# EAGLE schematic Word-Clock (EAGLE 7.3.0)

## Sheet 1 of 4
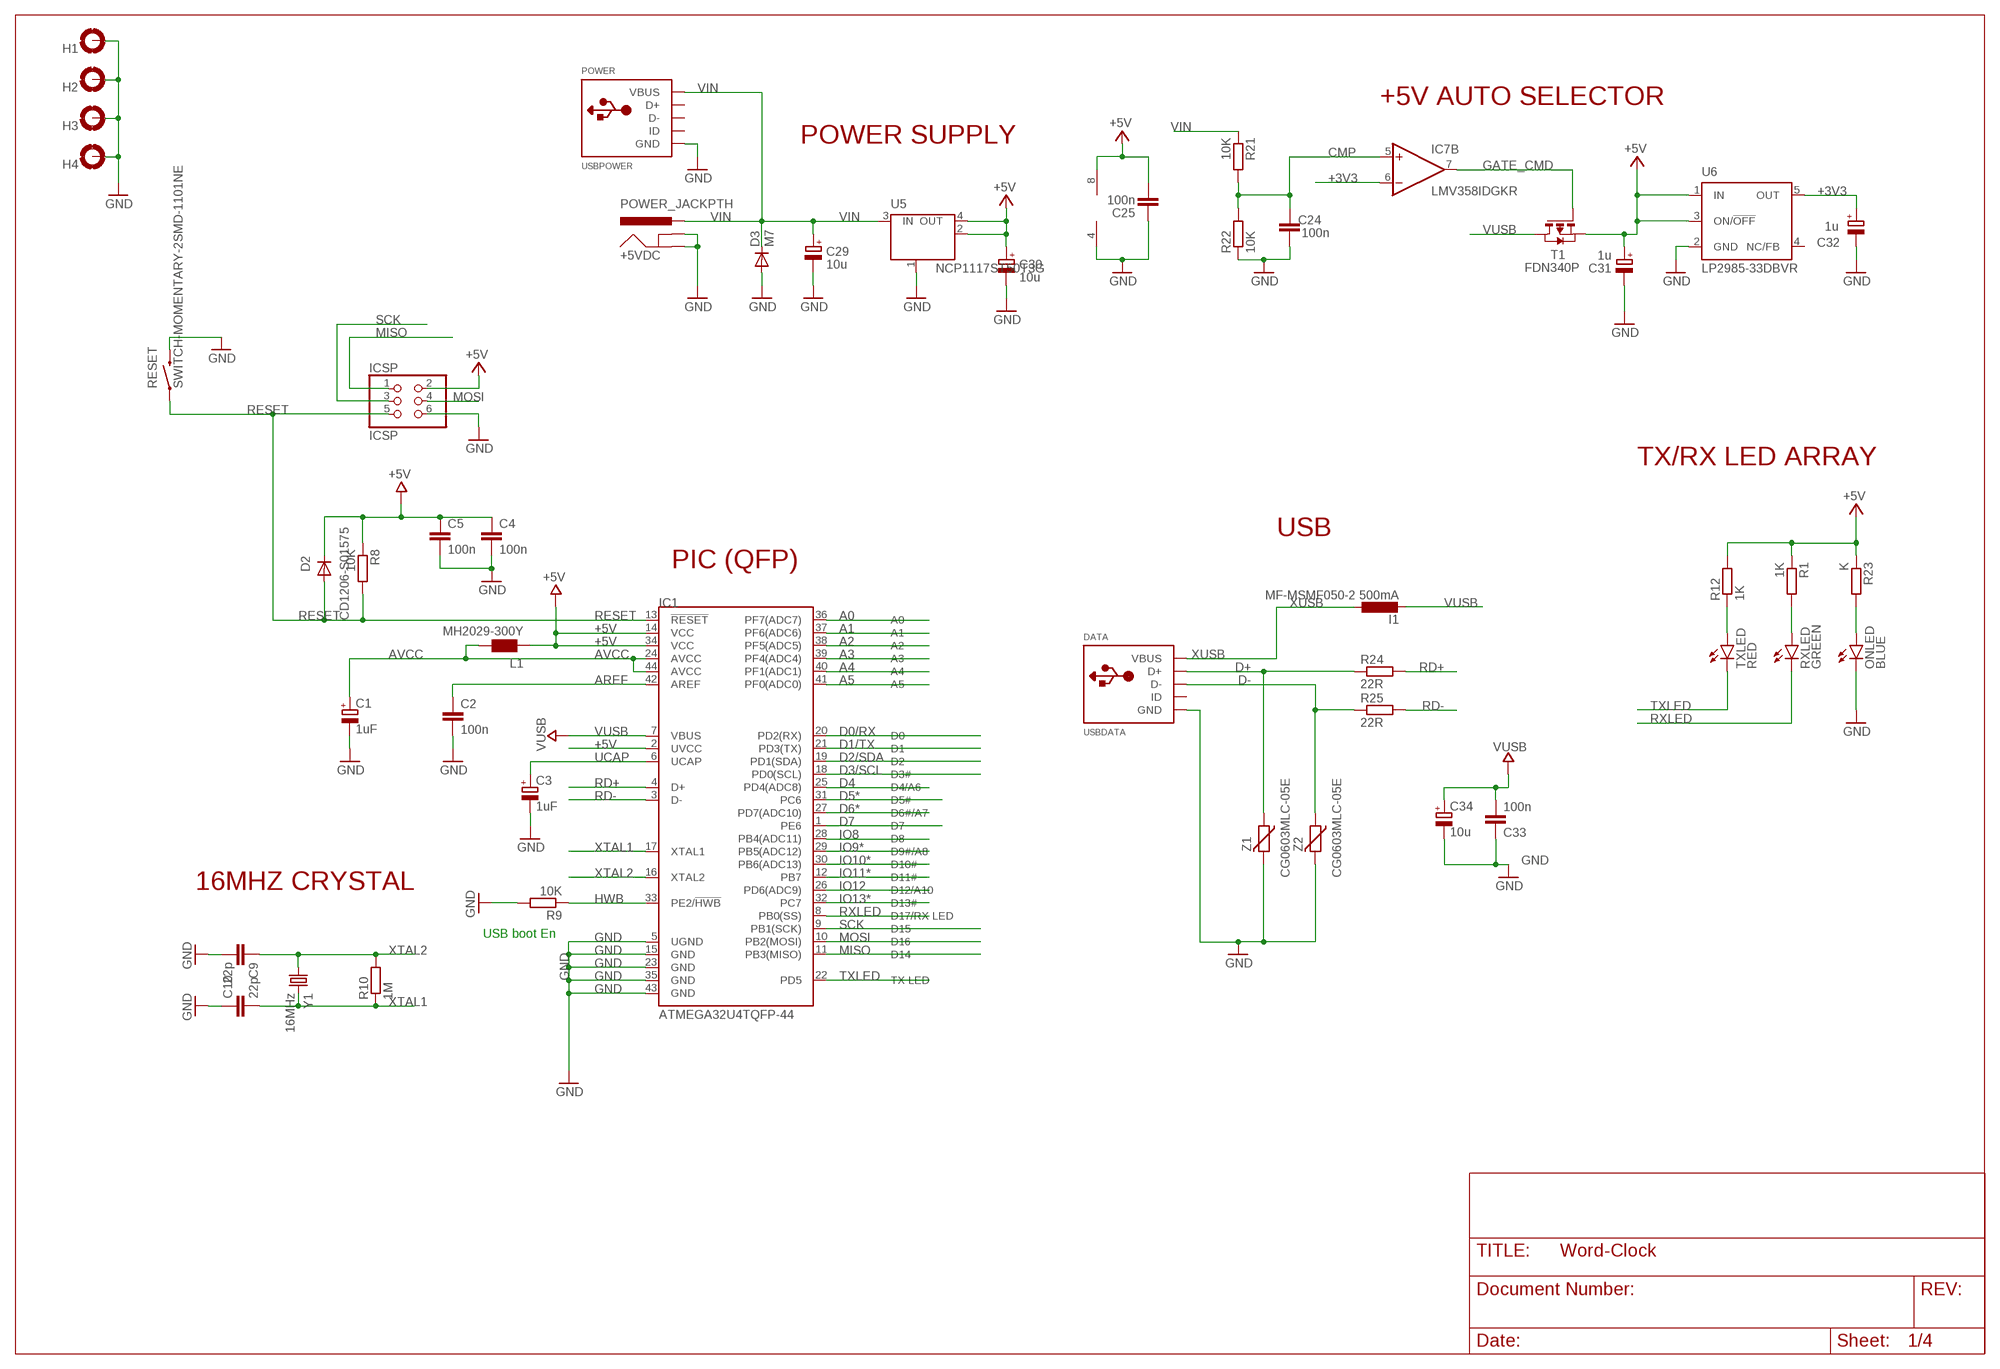
[diagram p0: schematic, sheet 1]

### Parts
+5VDC  POWER_JACKPTH  [POWER_JACK_PTH]
C1  1uF  CPOL-EUB/3528-21W  [B/3528-21W]
C2  100n  C-EUC1206  [C1206]
C3  1uF  CPOL-EUB/3528-21W  [B/3528-21W]
C4  100n  C-EUC1206  [C1206]
C5  100n  C-EUC1206  [C1206]
C9  22p  C-EUC1206  [C1206]
C10  22p  C-EUC1206  [C1206]
C24  100n  C-EUC1206  [C1206]
C25  100n  C-EUC1206  [C1206]
C29  10u  CPOL-EUB/3528-21W  [B/3528-21W]
C30  10u  CPOL-EUB/3528-21W  [B/3528-21W]
C31  1u  CPOL-EUB/3528-21W  [B/3528-21W]
C32  1u  CPOL-EUB/3528-21W  [B/3528-21W]
C33  100n  C-EUC1206  [C1206]
C34  10u  CPOL-EUB/3528-21W  [B/3528-21W]
D2  CD1206-S01575  DIODE-MINIMELF  [MINIMELF]
D3  M7  DIODE-SMB  [SMB]
DATA  USBDATA  USBMOLEX  [USB-MINIB-THM-MOLEX]
H1  MOUNT-PAD-ROUND2.8  [2,8-PAD]
H2  MOUNT-PAD-ROUND2.8  [2,8-PAD]
H3  MOUNT-PAD-ROUND2.8  [2,8-PAD]
H4  MOUNT-PAD-ROUND2.8  [2,8-PAD]
I1  MF-MSMF050-2 500mA  L-EUL1812  [L1812]
IC1  ATMEGA32U4TQFP-44  [TQFP44]
IC7  LMV358IDGKR  LMV358MX  [SO08]
ICSP  ICSP  PINHD-2X3/90  [2X03/90]
L1  MH2029-300Y  WE-CBF_0805  [0805]
ONLED  BLUE  LED-BLUE1206  [LED-1206]
POWER  USBPOWER  USBMOLEX  [USB-MINIB-THM-MOLEX]
R1  1K  R-EU_R1206  [R1206]
R8  10K  R-EU_R1206  [R1206]
R9  10K  R-EU_R1206  [R1206]
R10  1M  R-EU_R1206  [R1206]
R12  1K  R-EU_R1206  [R1206]
R21  10K  R-EU_R1206  [R1206]
R22  10K  R-EU_R1206  [R1206]
R23  K  R-EU_R1206  [R1206]
R24  22R  R-EU_R1206  [R1206]
R25  22R  R-EU_R1206  [R1206]
RESET  SWITCH-MOMENTARY-2SMD-1101NE  [TACTILE-SWITCH-1101NE]
RXLED  GREEN  LED-GREEN1206  [LED-1206]
T1  FDN340P  PMOSSOT23  [SOT-23]
TXLED  RED  LED-RED1206  [LED-1206]
U5  NCP1117ST50T3G  MC33269ST-3.3T3  [SOT223]
U6  LP2985-33DBVR  LP2985-XXDBVR33  [SOT23-DBV]
Y1  16MHz  CRYSTALSMD  [HC49UP]
Z1  CG0603MLC-05E  VARISTORCN0603  [CT/CN0603]
Z2  CG0603MLC-05E  VARISTORCN0603  [CT/CN0603]

### Nets
+3V3: C32.+ IC7.6(B:-IN) U6.5(OUT)
+5V [usbvcc]: C4.1 C5.1 C25.2 C30.+ C31.+ D2.C IC1.2(UVCC) IC1.14(VCC) IC1.34(VCC) IC7.8(P:V+) ICSP.2 L1.1 R1.1 R8.1 R12.2 R23.1 T1.2(S) U5.2(OUT) U5.4(OUT) U6.1(IN) U6.3(ON/!OFF) ; also sheet 2,3
A0: IC1.36(PF7(ADC7)) ; also sheet 3
A1: IC1.37(PF6(ADC6)) ; also sheet 3
A2: IC1.38(PF5(ADC5)) ; also sheet 3
A3: IC1.39(PF4(ADC4)) ; also sheet 3
A4: IC1.40(PF1(ADC1)) ; also sheet 3
A5: IC1.41(PF0(ADC0)) ; also sheet 3
AREF [aref]: C2.1 IC1.42(AREF)
AVCC: C1.+ IC1.24(AVCC) IC1.44(AVCC) L1.2
CMP: C24.2 IC7.5(B:+IN) R21.2 R22.2
D0/RX: IC1.20(PD2(RX)) ; also sheet 2
D1/TX: IC1.21(PD3(TX)) ; also sheet 2
D2/SDA: IC1.19(PD1(SDA)) ; also sheet 2
D3/SCL: IC1.18(PD0(SCL)) ; also sheet 2
D4: IC1.25(PD4(ADC8)) ; also sheet 3
D5*: IC1.31(PC6) ; also sheet 3
D6*: IC1.27(PD7(ADC10)) ; also sheet 3
D7: IC1.1(PE6) ; also sheet 4
D+: DATA.D+ R24.1 Z1.1
D-: DATA.D- R25.1 Z2.1
GATE_CMD: IC7.7(B:OUT) T1.3(G)
GND [gnd]: +5VDC.GND +5VDC.GNDBREAK C1.- C2.2 C3.- C4.2 C5.2 C9.2 C10.1 C24.1 C25.1 C29.- C30.- C31.- C32.- C33.1 C34.- D3.A DATA.GND H1.B2,8(MOUNT) H2.B2,8(MOUNT) H3.B2,8(MOUNT) H4.B2,8(MOUNT) IC1.5(UGND) IC1.15(GND) IC1.23(GND) IC1.35(GND) IC1.43(GND) IC7.4(P:V-) ICSP.6 ONLED.C POWER.GND R9.2 R22.1 RESET.2 U5.1(GND/ADJ) U6.2(GND) Z1.2 Z2.2 ; also sheet 2,3,4
HWB: IC1.33(PE2/!HWB) R9.1
IO8: IC1.28(PB4(ADC11)) ; also sheet 3
IO9*: IC1.29(PB5(ADC12)) ; also sheet 2
IO10*: IC1.30(PB6(ADC13)) ; also sheet 2
IO11*: IC1.12(PB7) ; also sheet 2
IO12: IC1.26(PD6(ADC9)) ; also sheet 3
IO13*: IC1.32(PC7) ; also sheet 3
MISO: IC1.11(PB3(MISO)) ICSP.1
MOSI: IC1.10(PB2(MOSI)) ICSP.4
N$1: R12.1 TXLED.A
N$2: R1.2 RXLED.A
N$3: ONLED.A R23.2
RD+: IC1.4(D+) R24.2
RD-: IC1.3(D-) R25.2
RESET: D2.A IC1.13(!RESET) ICSP.5 R8.2 RESET.1
RXLED: IC1.8(PB0(SS)) RXLED.C
SCK: IC1.9(PB1(SCK)) ICSP.3
TXLED: IC1.22(PD5) TXLED.C
UCAP: C3.+ IC1.6(UCAP)
VIN [power]: +5VDC.PWR C29.+ D3.C POWER.VBUS R21.1 U5.3(IN) ; also sheet 4
VUSB: C33.2 C34.+ I1.2 IC1.7(VBUS) T1.1(D)
XTAL1: C10.2 IC1.17(XTAL1) R10.1 Y1.2
XTAL2: C9.1 IC1.16(XTAL2) R10.2 Y1.1
XUSB [usbvcc]: DATA.VBUS I1.1
Unconnected: DATA.ID IC7.1(A:OUT) IC7.2(A:-IN) IC7.3(A:+IN) POWER.D+ POWER.D- POWER.ID U6.4(NC/FB)

### Notes on the sheet
- +5V AUTO SELECTOR
- POWER SUPPLY
- TX/RX LED ARRAY
- USB
- PIC (QFP)
- 16MHZ CRYSTAL
- USB boot En

## Sheet 2 of 4
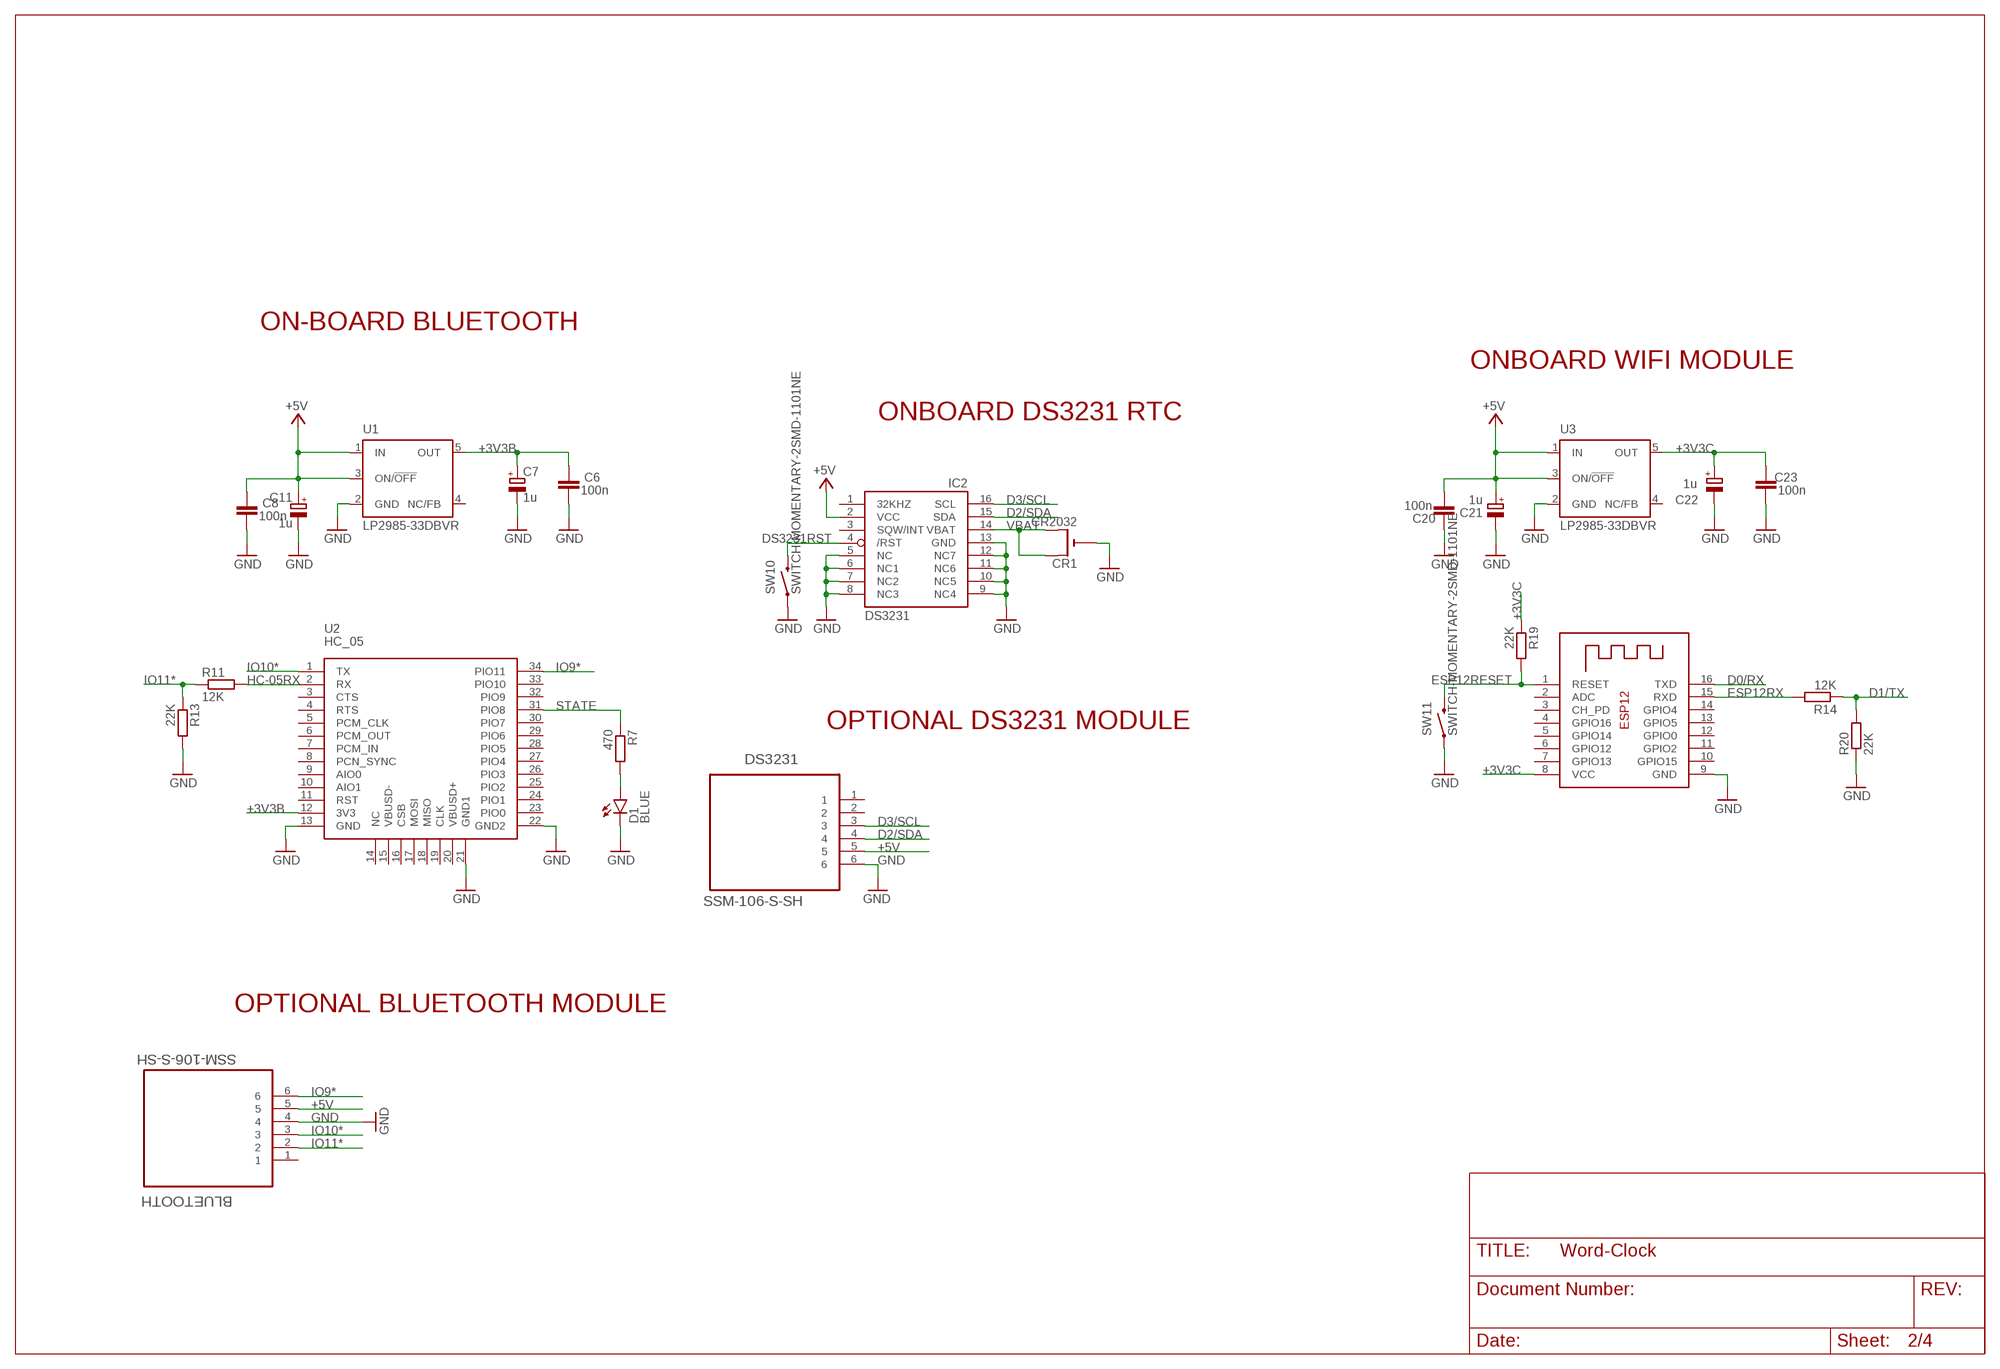
[diagram p1: schematic, sheet 2]

### Parts
BLUETOOTH  SSM-106-S-SH  [SAMTEC_SSM-106-S-SH]
C6  100n  C-EUC1206  [C1206]
C7  1u  CPOL-EUB/3528-21W  [B/3528-21W]
C8  100n  C-EUC1206  [C1206]
C11  1u  CPOL-EUB/3528-21W  [B/3528-21W]
C20  100n  C-EUC1206  [C1206]
C21  1u  CPOL-EUB/3528-21W  [B/3528-21W]
C22  1u  CPOL-EUB/3528-21W  [B/3528-21W]
C23  100n  C-EUC1206  [C1206]
CR1  CR2032  CR2032SMT  [CR2032-SMD]
D1  BLUE  LED-BLUE1206  [LED-1206]
DS3231  SSM-106-S-SH  [SAMTEC_SSM-106-S-SH]
ESP12  ESP12  ESP-12  [ESP-12]
IC2  DS3231/SO  [SO16W]
R7  470  R-EU_R1206  [R1206]
R11  12K  R-EU_R1206  [R1206]
R13  22K  R-EU_R1206  [R1206]
R14  12K  R-EU_R1206  [R1206]
R19  22K  R-EU_R1206  [R1206]
R20  22K  R-EU_R1206  [R1206]
SW10  SWITCH-MOMENTARY-2SMD-1101NE  [TACTILE-SWITCH-1101NE]
SW11  SWITCH-MOMENTARY-2SMD-1101NE  [TACTILE-SWITCH-1101NE]
U1  LP2985-33DBVR  LP2985-XXDBVR33  [SOT23-DBV]
U2  HC_05  [BLUETOOTH_SMD]
U3  LP2985-33DBVR  LP2985-XXDBVR33  [SOT23-DBV]

### Nets
+3V3B: C6.2 C7.+ U1.5(OUT) U2.12(3V3)
+3V3C: C22.+ C23.2 ESP12.8(VCC) R19.1 U3.5(OUT)
+5V [usbvcc]: BLUETOOTH.5 C8.2 C11.+ C20.1 C21.+ DS3231.5 IC2.2(VCC) U1.1(IN) U1.3(ON/!OFF) U3.1(IN) U3.3(ON/!OFF) ; also sheet 1,3
BLUETOOTHLED: D1.A R7.2
D0/RX: ESP12.16(TXD) ; also sheet 1
D1/TX: R14.1 R20.2 ; also sheet 1
D2/SDA: DS3231.4 IC2.15(SDA) ; also sheet 1
D3/SCL: DS3231.3 IC2.16(SCL) ; also sheet 1
DS3231RST: IC2.4(/RST) SW10.2
ESP12RESET: ESP12.1(RESET) R19.2 SW11.2
ESP12RX: ESP12.15(RXD) R14.2
GND [gnd]: BLUETOOTH.4 C6.1 C7.- C8.1 C11.- C20.2 C21.- C22.- C23.1 CR1.- D1.C DS3231.6 ESP12.9(GND) IC2.5(NC) IC2.6(NC1) IC2.7(NC2) IC2.8(NC3) IC2.9(NC4) IC2.10(NC5) IC2.11(NC6) IC2.12(NC7) IC2.13(GND) R13.2 R20.1 SW10.1 SW11.1 U1.2(GND) U2.13(GND) U2.21(GND1) U2.22(GND2) U3.2(GND) ; also sheet 1,3,4
HC-05RX: R11.2 U2.2(RX)
IO9*: BLUETOOTH.6 U2.34(PIO11) ; also sheet 1
IO10*: BLUETOOTH.3 U2.1(TX) ; also sheet 1
IO11*: BLUETOOTH.2 R11.1 R13.1 ; also sheet 1
STATE: R7.1 U2.31(PIO8)
VBAT: CR1.+$1(+) CR1.+$2(+1) IC2.14(VBAT)
Unconnected: BLUETOOTH.1 DS3231.1 DS3231.2 ESP12.2(ADC) ESP12.3(CH_PD) ESP12.4(GPIO16) ESP12.5(GPIO14) ESP12.6(GPIO12) ESP12.7(GPIO13) ESP12.10(GPIO15) ESP12.11(GPIO2) ESP12.12(GPIO0) ESP12.13(GPIO5) ESP12.14(GPIO4) IC2.1(32KHZ) IC2.3(SQW/INT) U1.4(NC/FB) U2.3(CTS) U2.4(RTS) U2.5(PCM_CLK) U2.6(PCM_OUT) U2.7(PCM_IN) U2.8(PCN_SYNC) U2.9(AIO0) U2.10(AIO1) U2.11(RST) U2.14(NC) U2.15(VBUSD-) U2.16(CSB) U2.17(MOSI) U2.18(MISO) U2.19(CLK) U2.20(VBUSD+) U2.23(PIO0) U2.24(PIO1) U2.25(PIO2) U2.26(PIO3) U2.27(PIO4) U2.28(PIO5) U2.29(PIO6) U2.30(PIO7) U2.32(PIO9) U2.33(PIO10) U3.4(NC/FB)

### Notes on the sheet
- ON-BOARD BLUETOOTH
- ONBOARD WIFI MODULE
- ONBOARD DS3231 RTC
- OPTIONAL DS3231 MODULE
- OPTIONAL BLUETOOTH MODULE

## Sheet 3 of 4
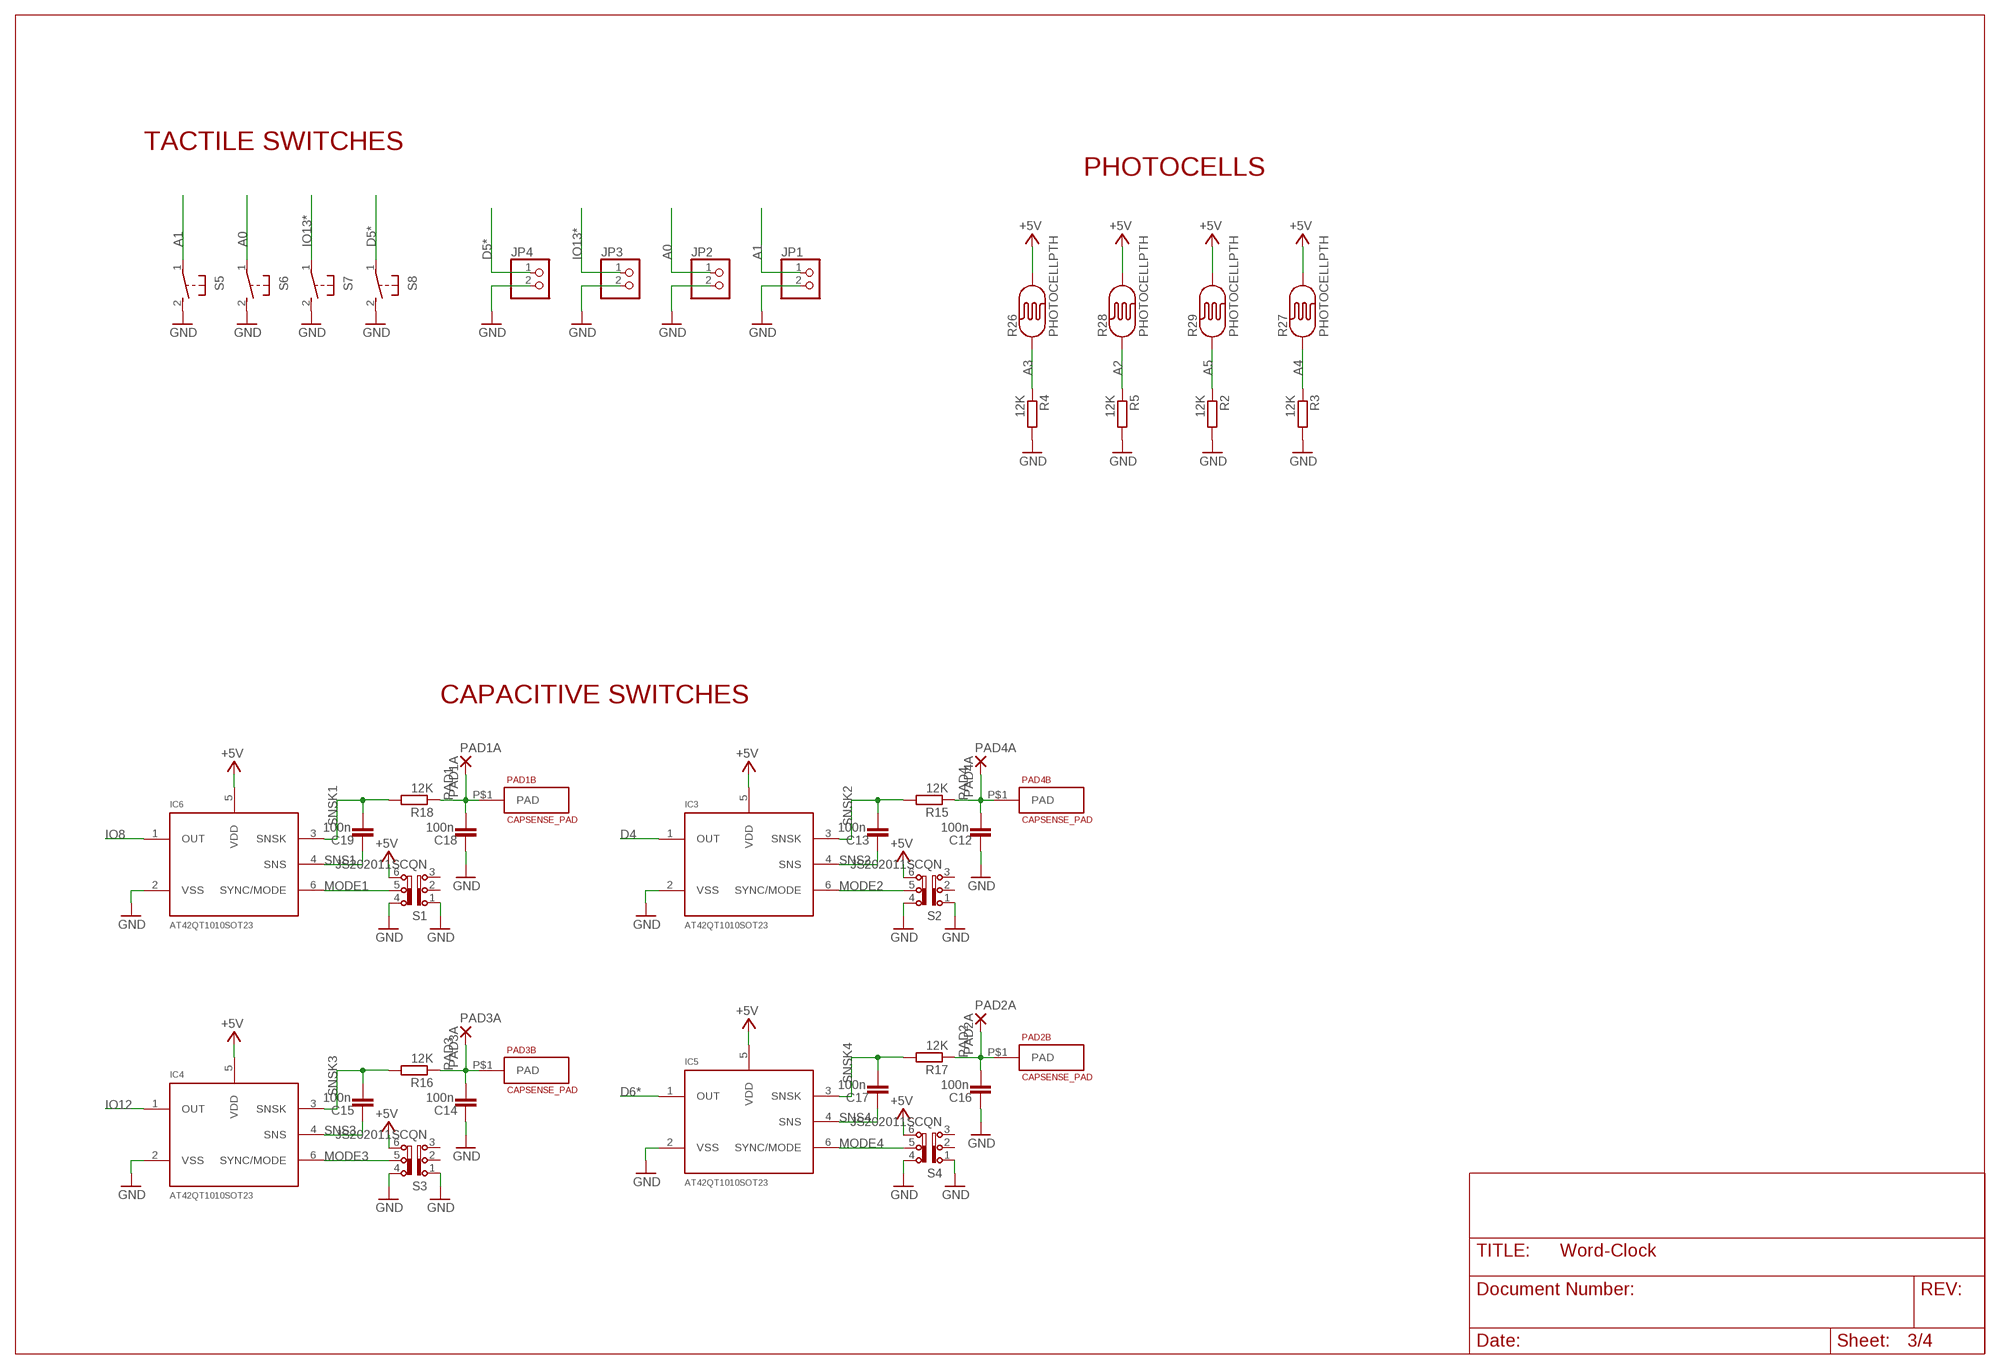
[diagram p2: schematic, sheet 3]

### Parts
C12  100n  C-EUC1206  [C1206]
C13  100n  C-EUC1206  [C1206]
C14  100n  C-EUC1206  [C1206]
C15  100n  C-EUC1206  [C1206]
C16  100n  C-EUC1206  [C1206]
C17  100n  C-EUC1206  [C1206]
C18  100n  C-EUC1206  [C1206]
C19  100n  C-EUC1206  [C1206]
IC3  AT42QT1010SOT23  [SOT23-6]
IC4  AT42QT1010SOT23  [SOT23-6]
IC5  AT42QT1010SOT23  [SOT23-6]
IC6  AT42QT1010SOT23  [SOT23-6]
JP1  PINHD-1X2/90  [1X02/90]
JP2  PINHD-1X2/90  [1X02/90]
JP3  PINHD-1X2/90  [1X02/90]
JP4  PINHD-1X2/90  [1X02/90]
PAD1A  PAD1A  2,54/1,0  [2,54/1,0]
PAD1B  CAPSENSE_PAD  [CAPSENSE_PAD]
PAD2A  PAD2A  2,54/1,0  [2,54/1,0]
PAD2B  CAPSENSE_PAD  [CAPSENSE_PAD]
PAD3A  PAD3A  2,54/1,0  [2,54/1,0]
PAD3B  CAPSENSE_PAD  [CAPSENSE_PAD]
PAD4A  PAD4A  2,54/1,0  [2,54/1,0]
PAD4B  CAPSENSE_PAD  [CAPSENSE_PAD]
R2  12K  R-EU_R1206  [R1206]
R3  12K  R-EU_R1206  [R1206]
R4  12K  R-EU_R1206  [R1206]
R5  12K  R-EU_R1206  [R1206]
R15  12K  R-EU_R1206  [R1206]
R16  12K  R-EU_R1206  [R1206]
R17  12K  R-EU_R1206  [R1206]
R18  12K  R-EU_R1206  [R1206]
R26  PHOTOCELLPTH  [PHOTOCELL]
R27  PHOTOCELLPTH  [PHOTOCELL]
R28  PHOTOCELLPTH  [PHOTOCELL]
R29  PHOTOCELLPTH  [PHOTOCELL]
S1  JS202011SCQN  [JS202011SCQN]
S2  JS202011SCQN  [JS202011SCQN]
S3  JS202011SCQN  [JS202011SCQN]
S4  JS202011SCQN  [JS202011SCQN]
S5  31-XX  [B3F-31XX]
S6  31-XX  [B3F-31XX]
S7  31-XX  [B3F-31XX]
S8  31-XX  [B3F-31XX]

### Nets
+5V [usbvcc]: IC3.5(VDD) IC4.5(VDD) IC5.5(VDD) IC6.5(VDD) R26.2 R27.2 R28.2 R29.2 S1.6 S2.6 S3.6 S4.6 ; also sheet 1,2
A0: JP2.1 S6.1(P) ; also sheet 1
A1: JP1.1 S5.1(P) ; also sheet 1
A2: R5.1 R28.1 ; also sheet 1
A3: R4.1 R26.1 ; also sheet 1
A4: R3.1 R27.1 ; also sheet 1
A5: R2.1 R29.1 ; also sheet 1
D4: IC3.1(OUT) ; also sheet 1
D5*: JP4.1 S8.1(P) ; also sheet 1
D6*: IC5.1(OUT) ; also sheet 1
GND [gnd]: C12.2 C14.2 C16.2 C18.2 IC3.2(VSS) IC4.2(VSS) IC5.2(VSS) IC6.2(VSS) JP1.2 JP2.2 JP3.2 JP4.2 R2.2 R3.2 R4.2 R5.2 S1.1 S1.4 S2.1 S2.4 S3.1 S3.4 S4.1 S4.4 S5.2(S) S6.2(S) S7.2(S) S8.2(S) ; also sheet 1,2,4
IO8: IC6.1(OUT) ; also sheet 1
IO12: IC4.1(OUT) ; also sheet 1
IO13*: JP3.1 S7.1(P) ; also sheet 1
MODE1: IC6.6(SYNC/MODE) S1.5
MODE2: IC3.6(SYNC/MODE) S2.5
MODE3: IC4.6(SYNC/MODE) S3.5
MODE4: IC5.6(SYNC/MODE) S4.5
PAD1: C18.1 PAD1A.1(P) PAD1B.P$1(PAD) R18.1
PAD2: C16.1 PAD2A.1(P) PAD2B.P$1(PAD) R17.1
PAD3: C14.1 PAD3A.1(P) PAD3B.P$1(PAD) R16.1
PAD4: C12.1 PAD4A.1(P) PAD4B.P$1(PAD) R15.1
SNS1: C19.2 IC6.4(SNS)
SNS2: C13.2 IC3.4(SNS)
SNS3: C15.2 IC4.4(SNS)
SNS4: C17.2 IC5.4(SNS)
SNSK1: C19.1 IC6.3(SNSK) R18.2
SNSK2: C13.1 IC3.3(SNSK) R15.2
SNSK3: C15.1 IC4.3(SNSK) R16.2
SNSK4: C17.1 IC5.3(SNSK) R17.2
Unconnected: S1.2 S1.3 S2.2 S2.3 S3.2 S3.3 S4.2 S4.3

### Notes on the sheet
- TACTILE SWITCHES
- PHOTOCELLS
- CAPACITIVE SWITCHES

## Sheet 4 of 4
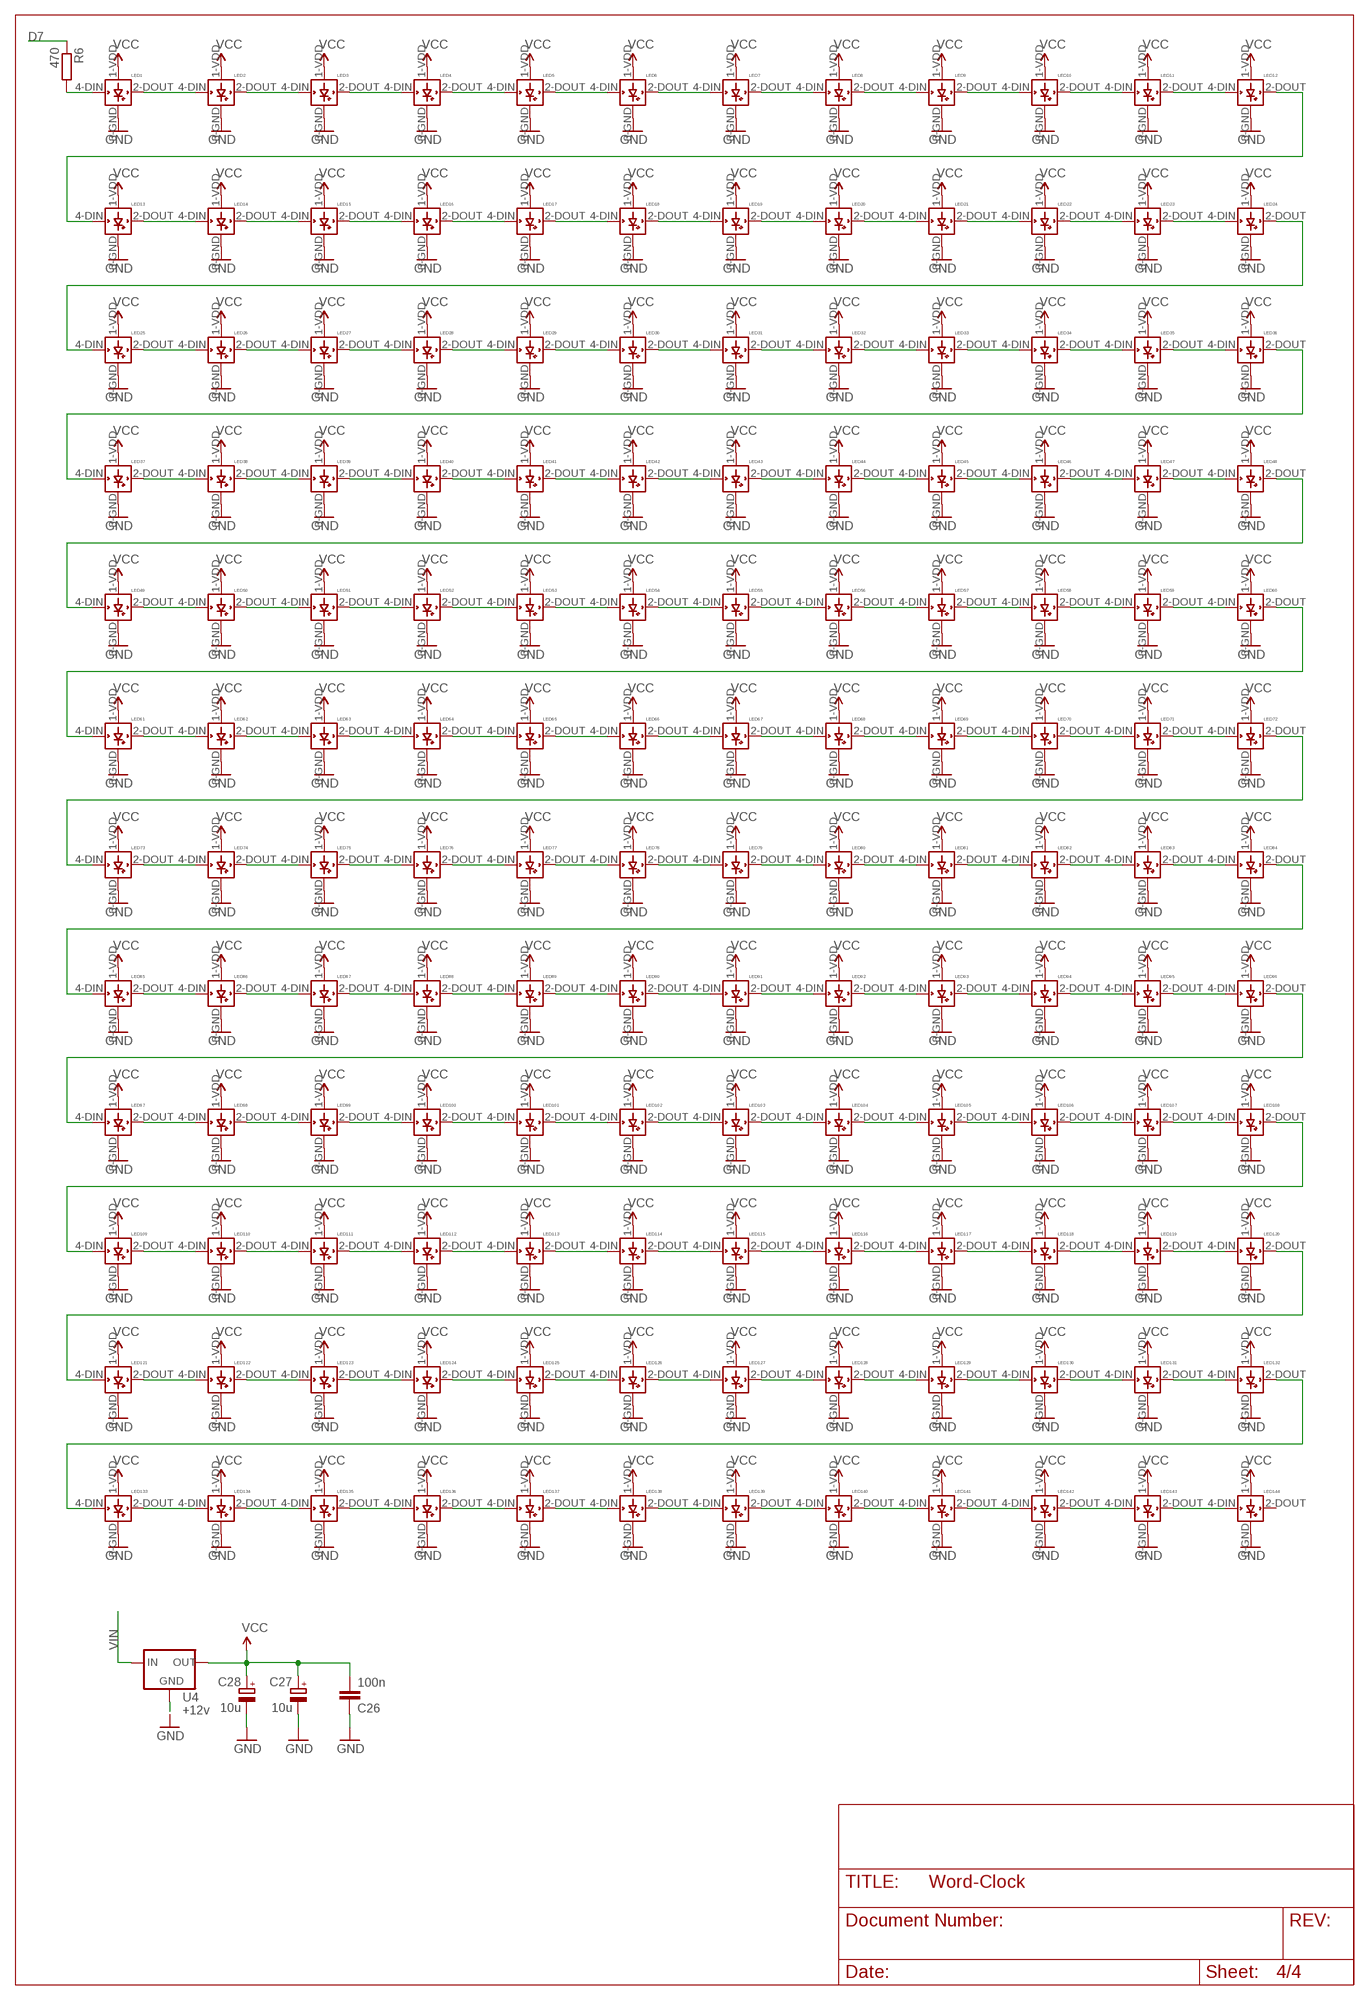
[diagram p3: schematic, sheet 4]

### Parts
C26  100n  C-EUC1206  [C1206]
C27  10u  CPOL-EUB/3528-21W  [B/3528-21W]
C28  10u  CPOL-EUB/3528-21W  [B/3528-21W]
LED1  WS2812B  [WS2812B]
LED2  WS2812B  [WS2812B]
LED3  WS2812B  [WS2812B]
LED4  WS2812B  [WS2812B]
LED5  WS2812B  [WS2812B]
LED6  WS2812B  [WS2812B]
LED7  WS2812B  [WS2812B]
LED8  WS2812B  [WS2812B]
LED9  WS2812B  [WS2812B]
LED10  WS2812B  [WS2812B]
LED11  WS2812B  [WS2812B]
LED12  WS2812B  [WS2812B]
LED13  WS2812B  [WS2812B]
LED14  WS2812B  [WS2812B]
LED15  WS2812B  [WS2812B]
LED16  WS2812B  [WS2812B]
LED17  WS2812B  [WS2812B]
LED18  WS2812B  [WS2812B]
LED19  WS2812B  [WS2812B]
LED20  WS2812B  [WS2812B]
LED21  WS2812B  [WS2812B]
LED22  WS2812B  [WS2812B]
LED23  WS2812B  [WS2812B]
LED24  WS2812B  [WS2812B]
LED25  WS2812B  [WS2812B]
LED26  WS2812B  [WS2812B]
LED27  WS2812B  [WS2812B]
LED28  WS2812B  [WS2812B]
LED29  WS2812B  [WS2812B]
LED30  WS2812B  [WS2812B]
LED31  WS2812B  [WS2812B]
LED32  WS2812B  [WS2812B]
LED33  WS2812B  [WS2812B]
LED34  WS2812B  [WS2812B]
LED35  WS2812B  [WS2812B]
LED36  WS2812B  [WS2812B]
LED37  WS2812B  [WS2812B]
LED38  WS2812B  [WS2812B]
LED39  WS2812B  [WS2812B]
LED40  WS2812B  [WS2812B]
LED41  WS2812B  [WS2812B]
LED42  WS2812B  [WS2812B]
LED43  WS2812B  [WS2812B]
LED44  WS2812B  [WS2812B]
LED45  WS2812B  [WS2812B]
LED46  WS2812B  [WS2812B]
LED47  WS2812B  [WS2812B]
LED48  WS2812B  [WS2812B]
LED49  WS2812B  [WS2812B]
LED50  WS2812B  [WS2812B]
LED51  WS2812B  [WS2812B]
LED52  WS2812B  [WS2812B]
LED53  WS2812B  [WS2812B]
LED54  WS2812B  [WS2812B]
LED55  WS2812B  [WS2812B]
LED56  WS2812B  [WS2812B]
LED57  WS2812B  [WS2812B]
LED58  WS2812B  [WS2812B]
LED59  WS2812B  [WS2812B]
LED60  WS2812B  [WS2812B]
LED61  WS2812B  [WS2812B]
LED62  WS2812B  [WS2812B]
LED63  WS2812B  [WS2812B]
LED64  WS2812B  [WS2812B]
LED65  WS2812B  [WS2812B]
LED66  WS2812B  [WS2812B]
LED67  WS2812B  [WS2812B]
LED68  WS2812B  [WS2812B]
LED69  WS2812B  [WS2812B]
LED70  WS2812B  [WS2812B]
LED71  WS2812B  [WS2812B]
LED72  WS2812B  [WS2812B]
LED73  WS2812B  [WS2812B]
LED74  WS2812B  [WS2812B]
LED75  WS2812B  [WS2812B]
LED76  WS2812B  [WS2812B]
LED77  WS2812B  [WS2812B]
LED78  WS2812B  [WS2812B]
LED79  WS2812B  [WS2812B]
LED80  WS2812B  [WS2812B]
LED81  WS2812B  [WS2812B]
LED82  WS2812B  [WS2812B]
LED83  WS2812B  [WS2812B]
LED84  WS2812B  [WS2812B]
LED85  WS2812B  [WS2812B]
LED86  WS2812B  [WS2812B]
LED87  WS2812B  [WS2812B]
LED88  WS2812B  [WS2812B]
LED89  WS2812B  [WS2812B]
LED90  WS2812B  [WS2812B]
LED91  WS2812B  [WS2812B]
LED92  WS2812B  [WS2812B]
LED93  WS2812B  [WS2812B]
LED94  WS2812B  [WS2812B]
LED95  WS2812B  [WS2812B]
LED96  WS2812B  [WS2812B]
LED97  WS2812B  [WS2812B]
LED98  WS2812B  [WS2812B]
LED99  WS2812B  [WS2812B]
LED100  WS2812B  [WS2812B]
LED101  WS2812B  [WS2812B]
LED102  WS2812B  [WS2812B]
LED103  WS2812B  [WS2812B]
LED104  WS2812B  [WS2812B]
LED105  WS2812B  [WS2812B]
LED106  WS2812B  [WS2812B]
LED107  WS2812B  [WS2812B]
LED108  WS2812B  [WS2812B]
LED109  WS2812B  [WS2812B]
LED110  WS2812B  [WS2812B]
LED111  WS2812B  [WS2812B]
LED112  WS2812B  [WS2812B]
LED113  WS2812B  [WS2812B]
LED114  WS2812B  [WS2812B]
LED115  WS2812B  [WS2812B]
LED116  WS2812B  [WS2812B]
LED117  WS2812B  [WS2812B]
LED118  WS2812B  [WS2812B]
LED119  WS2812B  [WS2812B]
LED120  WS2812B  [WS2812B]
LED121  WS2812B  [WS2812B]
LED122  WS2812B  [WS2812B]
LED123  WS2812B  [WS2812B]
LED124  WS2812B  [WS2812B]
LED125  WS2812B  [WS2812B]
LED126  WS2812B  [WS2812B]
LED127  WS2812B  [WS2812B]
LED128  WS2812B  [WS2812B]
LED129  WS2812B  [WS2812B]
LED130  WS2812B  [WS2812B]
LED131  WS2812B  [WS2812B]
LED132  WS2812B  [WS2812B]
LED133  WS2812B  [WS2812B]
LED134  WS2812B  [WS2812B]
LED135  WS2812B  [WS2812B]
LED136  WS2812B  [WS2812B]
LED137  WS2812B  [WS2812B]
LED138  WS2812B  [WS2812B]
LED139  WS2812B  [WS2812B]
LED140  WS2812B  [WS2812B]
LED141  WS2812B  [WS2812B]
LED142  WS2812B  [WS2812B]
LED143  WS2812B  [WS2812B]
LED144  WS2812B  [WS2812B]
R6  470  R-EU_R1206  [R1206]
U4  +12v  V_REG_78XX7812  [TO-252]

### Nets
D7: R6.1 ; also sheet 1
GND [gnd]: C26.1 C27.- C28.- LED1.3-GND(GND) LED2.3-GND(GND) LED3.3-GND(GND) LED4.3-GND(GND) LED5.3-GND(GND) LED6.3-GND(GND) LED7.3-GND(GND) LED8.3-GND(GND) LED9.3-GND(GND) LED10.3-GND(GND) LED11.3-GND(GND) LED12.3-GND(GND) LED13.3-GND(GND) LED14.3-GND(GND) LED15.3-GND(GND) LED16.3-GND(GND) LED17.3-GND(GND) LED18.3-GND(GND) LED19.3-GND(GND) LED20.3-GND(GND) LED21.3-GND(GND) LED22.3-GND(GND) LED23.3-GND(GND) LED24.3-GND(GND) LED25.3-GND(GND) LED26.3-GND(GND) LED27.3-GND(GND) LED28.3-GND(GND) LED29.3-GND(GND) LED30.3-GND(GND) LED31.3-GND(GND) LED32.3-GND(GND) LED33.3-GND(GND) LED34.3-GND(GND) LED35.3-GND(GND) LED36.3-GND(GND) LED37.3-GND(GND) LED38.3-GND(GND) LED39.3-GND(GND) LED40.3-GND(GND) LED41.3-GND(GND) LED42.3-GND(GND) LED43.3-GND(GND) LED44.3-GND(GND) LED45.3-GND(GND) LED46.3-GND(GND) LED47.3-GND(GND) LED48.3-GND(GND) LED49.3-GND(GND) LED50.3-GND(GND) LED51.3-GND(GND) LED52.3-GND(GND) LED53.3-GND(GND) LED54.3-GND(GND) LED55.3-GND(GND) LED56.3-GND(GND) LED57.3-GND(GND) LED58.3-GND(GND) LED59.3-GND(GND) LED60.3-GND(GND) LED61.3-GND(GND) LED62.3-GND(GND) LED63.3-GND(GND) LED64.3-GND(GND) LED65.3-GND(GND) LED66.3-GND(GND) LED67.3-GND(GND) LED68.3-GND(GND) LED69.3-GND(GND) LED70.3-GND(GND) LED71.3-GND(GND) LED72.3-GND(GND) LED73.3-GND(GND) LED74.3-GND(GND) LED75.3-GND(GND) LED76.3-GND(GND) LED77.3-GND(GND) LED78.3-GND(GND) LED79.3-GND(GND) LED80.3-GND(GND) LED81.3-GND(GND) LED82.3-GND(GND) LED83.3-GND(GND) LED84.3-GND(GND) LED85.3-GND(GND) LED86.3-GND(GND) LED87.3-GND(GND) LED88.3-GND(GND) LED89.3-GND(GND) LED90.3-GND(GND) LED91.3-GND(GND) LED92.3-GND(GND) LED93.3-GND(GND) LED94.3-GND(GND) LED95.3-GND(GND) LED96.3-GND(GND) LED97.3-GND(GND) LED98.3-GND(GND) LED99.3-GND(GND) LED100.3-GND(GND) LED101.3-GND(GND) LED102.3-GND(GND) LED103.3-GND(GND) LED104.3-GND(GND) LED105.3-GND(GND) LED106.3-GND(GND) LED107.3-GND(GND) LED108.3-GND(GND) LED109.3-GND(GND) LED110.3-GND(GND) LED111.3-GND(GND) LED112.3-GND(GND) LED113.3-GND(GND) LED114.3-GND(GND) LED115.3-GND(GND) LED116.3-GND(GND) LED117.3-GND(GND) LED118.3-GND(GND) LED119.3-GND(GND) LED120.3-GND(GND) LED121.3-GND(GND) LED122.3-GND(GND) LED123.3-GND(GND) LED124.3-GND(GND) LED125.3-GND(GND) LED126.3-GND(GND) LED127.3-GND(GND) LED128.3-GND(GND) LED129.3-GND(GND) LED130.3-GND(GND) LED131.3-GND(GND) LED132.3-GND(GND) LED133.3-GND(GND) LED134.3-GND(GND) LED135.3-GND(GND) LED136.3-GND(GND) LED137.3-GND(GND) LED138.3-GND(GND) LED139.3-GND(GND) LED140.3-GND(GND) LED141.3-GND(GND) LED142.3-GND(GND) LED143.3-GND(GND) LED144.3-GND(GND) U4.3(GND) ; also sheet 1,2,3
N$4: LED1.2-DOUT(DOUT) LED2.4-DIN(DIN)
N$5: LED2.2-DOUT(DOUT) LED3.4-DIN(DIN)
N$6: LED3.2-DOUT(DOUT) LED4.4-DIN(DIN)
N$7: LED4.2-DOUT(DOUT) LED5.4-DIN(DIN)
N$8: LED5.2-DOUT(DOUT) LED6.4-DIN(DIN)
N$9: LED6.2-DOUT(DOUT) LED7.4-DIN(DIN)
N$10: LED7.2-DOUT(DOUT) LED8.4-DIN(DIN)
N$11: LED8.2-DOUT(DOUT) LED9.4-DIN(DIN)
N$12: LED9.2-DOUT(DOUT) LED10.4-DIN(DIN)
N$13: LED10.2-DOUT(DOUT) LED11.4-DIN(DIN)
N$14: LED11.2-DOUT(DOUT) LED12.4-DIN(DIN)
N$15: LED13.2-DOUT(DOUT) LED14.4-DIN(DIN)
N$16: LED14.2-DOUT(DOUT) LED15.4-DIN(DIN)
N$17: LED15.2-DOUT(DOUT) LED16.4-DIN(DIN)
N$18: LED16.2-DOUT(DOUT) LED17.4-DIN(DIN)
N$19: LED17.2-DOUT(DOUT) LED18.4-DIN(DIN)
N$20: LED18.2-DOUT(DOUT) LED19.4-DIN(DIN)
N$21: LED19.2-DOUT(DOUT) LED20.4-DIN(DIN)
N$22: LED20.2-DOUT(DOUT) LED21.4-DIN(DIN)
N$23: LED21.2-DOUT(DOUT) LED22.4-DIN(DIN)
N$24: LED22.2-DOUT(DOUT) LED23.4-DIN(DIN)
N$25: LED23.2-DOUT(DOUT) LED24.4-DIN(DIN)
N$26: LED25.2-DOUT(DOUT) LED26.4-DIN(DIN)
N$27: LED26.2-DOUT(DOUT) LED27.4-DIN(DIN)
N$28: LED27.2-DOUT(DOUT) LED28.4-DIN(DIN)
N$29: LED28.2-DOUT(DOUT) LED29.4-DIN(DIN)
N$30: LED29.2-DOUT(DOUT) LED30.4-DIN(DIN)
N$31: LED30.2-DOUT(DOUT) LED31.4-DIN(DIN)
N$32: LED31.2-DOUT(DOUT) LED32.4-DIN(DIN)
N$33: LED32.2-DOUT(DOUT) LED33.4-DIN(DIN)
N$34: LED33.2-DOUT(DOUT) LED34.4-DIN(DIN)
N$35: LED34.2-DOUT(DOUT) LED35.4-DIN(DIN)
N$36: LED35.2-DOUT(DOUT) LED36.4-DIN(DIN)
N$37: LED37.2-DOUT(DOUT) LED38.4-DIN(DIN)
N$38: LED38.2-DOUT(DOUT) LED39.4-DIN(DIN)
N$39: LED39.2-DOUT(DOUT) LED40.4-DIN(DIN)
N$40: LED40.2-DOUT(DOUT) LED41.4-DIN(DIN)
N$41: LED41.2-DOUT(DOUT) LED42.4-DIN(DIN)
N$42: LED42.2-DOUT(DOUT) LED43.4-DIN(DIN)
N$43: LED43.2-DOUT(DOUT) LED44.4-DIN(DIN)
N$44: LED44.2-DOUT(DOUT) LED45.4-DIN(DIN)
N$45: LED45.2-DOUT(DOUT) LED46.4-DIN(DIN)
N$46: LED46.2-DOUT(DOUT) LED47.4-DIN(DIN)
N$47: LED47.2-DOUT(DOUT) LED48.4-DIN(DIN)
N$48: LED49.2-DOUT(DOUT) LED50.4-DIN(DIN)
N$49: LED50.2-DOUT(DOUT) LED51.4-DIN(DIN)
N$50: LED51.2-DOUT(DOUT) LED52.4-DIN(DIN)
N$51: LED52.2-DOUT(DOUT) LED53.4-DIN(DIN)
N$52: LED53.2-DOUT(DOUT) LED54.4-DIN(DIN)
N$53: LED54.2-DOUT(DOUT) LED55.4-DIN(DIN)
N$54: LED55.2-DOUT(DOUT) LED56.4-DIN(DIN)
N$55: LED56.2-DOUT(DOUT) LED57.4-DIN(DIN)
N$56: LED57.2-DOUT(DOUT) LED58.4-DIN(DIN)
N$57: LED58.2-DOUT(DOUT) LED59.4-DIN(DIN)
N$58: LED59.2-DOUT(DOUT) LED60.4-DIN(DIN)
N$59: LED61.2-DOUT(DOUT) LED62.4-DIN(DIN)
N$60: LED62.2-DOUT(DOUT) LED63.4-DIN(DIN)
N$61: LED63.2-DOUT(DOUT) LED64.4-DIN(DIN)
N$62: LED64.2-DOUT(DOUT) LED65.4-DIN(DIN)
N$63: LED65.2-DOUT(DOUT) LED66.4-DIN(DIN)
N$64: LED66.2-DOUT(DOUT) LED67.4-DIN(DIN)
N$65: LED67.2-DOUT(DOUT) LED68.4-DIN(DIN)
N$66: LED68.2-DOUT(DOUT) LED69.4-DIN(DIN)
N$67: LED69.2-DOUT(DOUT) LED70.4-DIN(DIN)
N$68: LED70.2-DOUT(DOUT) LED71.4-DIN(DIN)
N$69: LED71.2-DOUT(DOUT) LED72.4-DIN(DIN)
N$70: LED73.2-DOUT(DOUT) LED74.4-DIN(DIN)
N$71: LED74.2-DOUT(DOUT) LED75.4-DIN(DIN)
N$72: LED75.2-DOUT(DOUT) LED76.4-DIN(DIN)
N$73: LED76.2-DOUT(DOUT) LED77.4-DIN(DIN)
N$74: LED77.2-DOUT(DOUT) LED78.4-DIN(DIN)
N$75: LED78.2-DOUT(DOUT) LED79.4-DIN(DIN)
N$76: LED79.2-DOUT(DOUT) LED80.4-DIN(DIN)
N$77: LED80.2-DOUT(DOUT) LED81.4-DIN(DIN)
N$78: LED81.2-DOUT(DOUT) LED82.4-DIN(DIN)
N$79: LED82.2-DOUT(DOUT) LED83.4-DIN(DIN)
N$80: LED83.2-DOUT(DOUT) LED84.4-DIN(DIN)
N$81: LED85.2-DOUT(DOUT) LED86.4-DIN(DIN)
N$82: LED86.2-DOUT(DOUT) LED87.4-DIN(DIN)
N$83: LED87.2-DOUT(DOUT) LED88.4-DIN(DIN)
N$84: LED88.2-DOUT(DOUT) LED89.4-DIN(DIN)
N$85: LED89.2-DOUT(DOUT) LED90.4-DIN(DIN)
N$86: LED90.2-DOUT(DOUT) LED91.4-DIN(DIN)
N$87: LED91.2-DOUT(DOUT) LED92.4-DIN(DIN)
N$88: LED92.2-DOUT(DOUT) LED93.4-DIN(DIN)
N$89: LED93.2-DOUT(DOUT) LED94.4-DIN(DIN)
N$90: LED94.2-DOUT(DOUT) LED95.4-DIN(DIN)
N$91: LED95.2-DOUT(DOUT) LED96.4-DIN(DIN)
N$92: LED97.2-DOUT(DOUT) LED98.4-DIN(DIN)
N$93: LED98.2-DOUT(DOUT) LED99.4-DIN(DIN)
N$94: LED99.2-DOUT(DOUT) LED100.4-DIN(DIN)
N$95: LED100.2-DOUT(DOUT) LED101.4-DIN(DIN)
N$96: LED101.2-DOUT(DOUT) LED102.4-DIN(DIN)
N$97: LED102.2-DOUT(DOUT) LED103.4-DIN(DIN)
N$98: LED103.2-DOUT(DOUT) LED104.4-DIN(DIN)
N$99: LED104.2-DOUT(DOUT) LED105.4-DIN(DIN)
N$100: LED105.2-DOUT(DOUT) LED106.4-DIN(DIN)
N$101: LED106.2-DOUT(DOUT) LED107.4-DIN(DIN)
N$102: LED107.2-DOUT(DOUT) LED108.4-DIN(DIN)
N$103: LED109.2-DOUT(DOUT) LED110.4-DIN(DIN)
N$104: LED110.2-DOUT(DOUT) LED111.4-DIN(DIN)
N$105: LED111.2-DOUT(DOUT) LED112.4-DIN(DIN)
N$106: LED112.2-DOUT(DOUT) LED113.4-DIN(DIN)
N$107: LED113.2-DOUT(DOUT) LED114.4-DIN(DIN)
N$108: LED114.2-DOUT(DOUT) LED115.4-DIN(DIN)
N$109: LED115.2-DOUT(DOUT) LED116.4-DIN(DIN)
N$110: LED116.2-DOUT(DOUT) LED117.4-DIN(DIN)
N$111: LED117.2-DOUT(DOUT) LED118.4-DIN(DIN)
N$112: LED118.2-DOUT(DOUT) LED119.4-DIN(DIN)
N$113: LED119.2-DOUT(DOUT) LED120.4-DIN(DIN)
N$114: LED121.2-DOUT(DOUT) LED122.4-DIN(DIN)
N$115: LED122.2-DOUT(DOUT) LED123.4-DIN(DIN)
N$116: LED123.2-DOUT(DOUT) LED124.4-DIN(DIN)
N$117: LED124.2-DOUT(DOUT) LED125.4-DIN(DIN)
N$118: LED125.2-DOUT(DOUT) LED126.4-DIN(DIN)
N$119: LED126.2-DOUT(DOUT) LED127.4-DIN(DIN)
N$120: LED127.2-DOUT(DOUT) LED128.4-DIN(DIN)
N$121: LED128.2-DOUT(DOUT) LED129.4-DIN(DIN)
N$122: LED129.2-DOUT(DOUT) LED130.4-DIN(DIN)
N$123: LED130.2-DOUT(DOUT) LED131.4-DIN(DIN)
N$124: LED131.2-DOUT(DOUT) LED132.4-DIN(DIN)
N$125: LED133.2-DOUT(DOUT) LED134.4-DIN(DIN)
N$126: LED134.2-DOUT(DOUT) LED135.4-DIN(DIN)
N$127: LED135.2-DOUT(DOUT) LED136.4-DIN(DIN)
N$128: LED136.2-DOUT(DOUT) LED137.4-DIN(DIN)
N$129: LED137.2-DOUT(DOUT) LED138.4-DIN(DIN)
N$130: LED138.2-DOUT(DOUT) LED139.4-DIN(DIN)
N$131: LED139.2-DOUT(DOUT) LED140.4-DIN(DIN)
N$132: LED140.2-DOUT(DOUT) LED141.4-DIN(DIN)
N$133: LED141.2-DOUT(DOUT) LED142.4-DIN(DIN)
N$134: LED142.2-DOUT(DOUT) LED143.4-DIN(DIN)
N$135: LED143.2-DOUT(DOUT) LED144.4-DIN(DIN)
N$136: LED12.2-DOUT(DOUT) LED13.4-DIN(DIN)
N$137: LED24.2-DOUT(DOUT) LED25.4-DIN(DIN)
N$138: LED36.2-DOUT(DOUT) LED37.4-DIN(DIN)
N$139: LED48.2-DOUT(DOUT) LED49.4-DIN(DIN)
N$140: LED60.2-DOUT(DOUT) LED61.4-DIN(DIN)
N$141: LED72.2-DOUT(DOUT) LED73.4-DIN(DIN)
N$142: LED84.2-DOUT(DOUT) LED85.4-DIN(DIN)
N$143: LED96.2-DOUT(DOUT) LED97.4-DIN(DIN)
N$144: LED108.2-DOUT(DOUT) LED109.4-DIN(DIN)
N$145: LED120.2-DOUT(DOUT) LED121.4-DIN(DIN)
N$146: LED132.2-DOUT(DOUT) LED133.4-DIN(DIN)
N$147: LED1.4-DIN(DIN) R6.2
VCC: C26.2 C27.+ C28.+ LED1.1-VDD(VDD) LED2.1-VDD(VDD) LED3.1-VDD(VDD) LED4.1-VDD(VDD) LED5.1-VDD(VDD) LED6.1-VDD(VDD) LED7.1-VDD(VDD) LED8.1-VDD(VDD) LED9.1-VDD(VDD) LED10.1-VDD(VDD) LED11.1-VDD(VDD) LED12.1-VDD(VDD) LED13.1-VDD(VDD) LED14.1-VDD(VDD) LED15.1-VDD(VDD) LED16.1-VDD(VDD) LED17.1-VDD(VDD) LED18.1-VDD(VDD) LED19.1-VDD(VDD) LED20.1-VDD(VDD) LED21.1-VDD(VDD) LED22.1-VDD(VDD) LED23.1-VDD(VDD) LED24.1-VDD(VDD) LED25.1-VDD(VDD) LED26.1-VDD(VDD) LED27.1-VDD(VDD) LED28.1-VDD(VDD) LED29.1-VDD(VDD) LED30.1-VDD(VDD) LED31.1-VDD(VDD) LED32.1-VDD(VDD) LED33.1-VDD(VDD) LED34.1-VDD(VDD) LED35.1-VDD(VDD) LED36.1-VDD(VDD) LED37.1-VDD(VDD) LED38.1-VDD(VDD) LED39.1-VDD(VDD) LED40.1-VDD(VDD) LED41.1-VDD(VDD) LED42.1-VDD(VDD) LED43.1-VDD(VDD) LED44.1-VDD(VDD) LED45.1-VDD(VDD) LED46.1-VDD(VDD) LED47.1-VDD(VDD) LED48.1-VDD(VDD) LED49.1-VDD(VDD) LED50.1-VDD(VDD) LED51.1-VDD(VDD) LED52.1-VDD(VDD) LED53.1-VDD(VDD) LED54.1-VDD(VDD) LED55.1-VDD(VDD) LED56.1-VDD(VDD) LED57.1-VDD(VDD) LED58.1-VDD(VDD) LED59.1-VDD(VDD) LED60.1-VDD(VDD) LED61.1-VDD(VDD) LED62.1-VDD(VDD) LED63.1-VDD(VDD) LED64.1-VDD(VDD) LED65.1-VDD(VDD) LED66.1-VDD(VDD) LED67.1-VDD(VDD) LED68.1-VDD(VDD) LED69.1-VDD(VDD) LED70.1-VDD(VDD) LED71.1-VDD(VDD) LED72.1-VDD(VDD) LED73.1-VDD(VDD) LED74.1-VDD(VDD) LED75.1-VDD(VDD) LED76.1-VDD(VDD) LED77.1-VDD(VDD) LED78.1-VDD(VDD) LED79.1-VDD(VDD) LED80.1-VDD(VDD) LED81.1-VDD(VDD) LED82.1-VDD(VDD) LED83.1-VDD(VDD) LED84.1-VDD(VDD) LED85.1-VDD(VDD) LED86.1-VDD(VDD) LED87.1-VDD(VDD) LED88.1-VDD(VDD) LED89.1-VDD(VDD) LED90.1-VDD(VDD) LED91.1-VDD(VDD) LED92.1-VDD(VDD) LED93.1-VDD(VDD) LED94.1-VDD(VDD) LED95.1-VDD(VDD) LED96.1-VDD(VDD) LED97.1-VDD(VDD) LED98.1-VDD(VDD) LED99.1-VDD(VDD) LED100.1-VDD(VDD) LED101.1-VDD(VDD) LED102.1-VDD(VDD) LED103.1-VDD(VDD) LED104.1-VDD(VDD) LED105.1-VDD(VDD) LED106.1-VDD(VDD) LED107.1-VDD(VDD) LED108.1-VDD(VDD) LED109.1-VDD(VDD) LED110.1-VDD(VDD) LED111.1-VDD(VDD) LED112.1-VDD(VDD) LED113.1-VDD(VDD) LED114.1-VDD(VDD) LED115.1-VDD(VDD) LED116.1-VDD(VDD) LED117.1-VDD(VDD) LED118.1-VDD(VDD) LED119.1-VDD(VDD) LED120.1-VDD(VDD) LED121.1-VDD(VDD) LED122.1-VDD(VDD) LED123.1-VDD(VDD) LED124.1-VDD(VDD) LED125.1-VDD(VDD) LED126.1-VDD(VDD) LED127.1-VDD(VDD) LED128.1-VDD(VDD) LED129.1-VDD(VDD) LED130.1-VDD(VDD) LED131.1-VDD(VDD) LED132.1-VDD(VDD) LED133.1-VDD(VDD) LED134.1-VDD(VDD) LED135.1-VDD(VDD) LED136.1-VDD(VDD) LED137.1-VDD(VDD) LED138.1-VDD(VDD) LED139.1-VDD(VDD) LED140.1-VDD(VDD) LED141.1-VDD(VDD) LED142.1-VDD(VDD) LED143.1-VDD(VDD) LED144.1-VDD(VDD) U4.2(OUT)
VIN [power]: U4.1(IN) ; also sheet 1
Unconnected: LED144.2-DOUT(DOUT)

## Library data of the parts
+5VDC = SparkFun-Connectors:POWER_JACK: Power Jack This is the standard 5.5mm barrel jack for power. The PTH is the most common, proven, reliable, footprint. The Slot footprint only works if the mill layer is transmitted to the PCB fab house so be warned. Mating wall wart : TOL-00298 (and others); PROD_ID: CONN-08197
BLUETOOTH DS3231 = SAMTEC-FLE-Mxx-Sxx_By_element14_Batch_1:SSM-106-S-SH: CONN SOCKET, 2.54MM, SMT, R/A, 1X6WAY; MPN: SSM-106-S-SH; OC_FARNELL: -; OC_NEWARK: 11P7878; PACKAGE: SOCKET, 2.54MM, SMT, R/A, 1X6WAY; SUPPLIER: Samtec
C1 C3 C7 C11 C21 C22 C27-C32 C34 = resistor:CPOL-EU: POLARIZED CAPACITOR, European symbol
C2 C4-C6 C8-C10 C12-C20 C23-C26 C33 = resistor:C-EU: CAPACITOR, European symbol
CR1 = adafruit:CR2032
D1 = SparkFun-LED:LED-BLUE: Blue LEDs for production use Various blue LEDs stocked by SparkFun production 0603 - DIO-08575 Rebel - DIO-09553 1206 - DIO-09911; PROD_ID: DIO-09911
D2 D3 = diode:DIODE-: DIODE
DATA POWER = adafruit:USB: USB Connectors USBMINIB - Surface Mount Female Mini-B USB Connector 4UConnector: 06564 By microbuilder.eu Thru-hole RA Female Mini-B USB Connector 4UConnector: 18732 By ladyada.net
ESP12 = adafruit:ESP-12
H1-H4 = holes:MOUNT-PAD-ROUND: MOUNTING PAD, round
I1 = rcl:L-EU: INDUCTOR, European symbol
IC1 = SparkFun-DigitalIC:ATMEGA32U4: Atmel 44-pin 8-bit Microcontroller with 32KBytes of ISP Flash and USB Controller
IC2 = adafruit:DS3231
IC3-IC6 = SparkFun-DigitalIC:AT42QT1010
IC7 = linear:LMV358?*: Dual General Purpose, Low Voltage, Rail-to-Rail Output Operational Amplifiers Source: http://www.national.com/mpf/LM/LMV321.html http://www.national.com/dt/lmv_qual.pdf
ICSP = pinhead:PINHD-2X3: PIN HEADER
JP1-JP4 = pinhead:PINHD-1X2: PIN HEADER
L1 = wuerth-elektronik:WE-CBF: SMD EMI Suppression Ferrite Beads - excellent anti-EMI properties - low DCR - impedances till 3000 ohms - rated current up to 6 A
LED1-LED144 = adafruit:WS2812B
ONLED = SparkFun-LED:LED-BLUE: Blue LEDs for production use Various blue LEDs stocked by SparkFun production 0603 - DIO-08575 Rebel - DIO-09553 1206 - DIO-09911; FARNELL: 2322084; PROD_ID: DIO-09911
PAD1A PAD2A PAD3A PAD4A = wirepad:2,54/1,0: THROUGH-HOLE PAD
PAD1B PAD2B PAD3B PAD4B = David:CAPSENSE_PAD: Generic copper pad for a capacitive touch sensor.
R1-R25 = resistor:R-EU_: RESISTOR, European symbol
R26-R29 = SparkFun-Sensors:PHOTOCELL: CdS photoresistor. This is a low cost way to detect light levels. Resistance decreases with more incoming light. SparkFun SKU: SEN-09088
RESET SW10 SW11 = SparkFun-Electromechanical:SWITCH-MOMENTARY-2: Various NO switches- pushbuttons, reed, etc; PROD_ID: 1703878
RXLED = SparkFun-LED:LED-GREEN: Various green LEDs Green LEDs used in SFE Production 0603- DIO-00821 LARGE- DIO-00862 LILYPAD- DIO-09910; FARNELL: 2322085; PROD_ID: DIO-00862
S1-S4 = switch-ck:JS202011SCQN: DPDT SLIDE SWITCH
S5-S8 = switch-omron:31-XX: OMRON SWITCH; MPN: B3F-3100; OC_FARNELL: 959704; OC_NEWARK: 36M3582
T1 = zetex:PMOSSOT23: MOS FET; OC_FARNELL: unknown; OC_NEWARK: unknown
TXLED = SparkFun-LED:LED-RED: Assorted Red LEDs LilyPad 1206- DIO-09912 1206- DIO-00809 0603- DIO-00819 "SMART" means more efficient and expensive; PROD_ID: DIO-09912
U1 U3 U6 = SmartPrj:LP2985-XXDBVR: ULTRALOW-POWER 50-mA LOW-DROPOUT LINEAR REGULATORS 50-mA Low-Dropout Regulator Source: http://focus.ti.com/lit/ds/symlink/tps77001.pdf
U2 = SerialPortBluetooth:HC_05
U4 = SparkFun-PowerIC:V_REG_78XX: Voltage Regulator Standard 78xx regulator. IGO (Input Ground Output). Spark Fun Electronics SKU : COM-00107; PROD_ID: VREG-12370
U5 = linear:MC33269ST*: Adjustable Output Low Dropout Voltage Regulator 800 mA Source: http://www.onsemi.com/pub/Collateral/MC33269-D.PDF; FARNELL: 1147874
Y1 = SparkFun-FreqCtrl:CRYSTAL: Various standard crystals. Proven footprints.
Z1 Z2 = varistor:VARISTOR: VARISTOR

## Net classes
0 default: width 0.254 mm, drill 0.61 mm, clearance 0.254 mm
1 power: width 0.254 mm, drill 0.61 mm, clearance 0.254 mm
2 gnd: width 0.254 mm, drill 0.61 mm, clearance 0.254 mm
3 usbvcc: width 0.254 mm, drill 0.61 mm, clearance 0.254 mm
4 aref: width 0.254 mm, drill 0.61 mm, clearance 0.254 mm